# EAGLE board Sequencer-Memory-V1.0-3 (EAGLE 7.6.0)
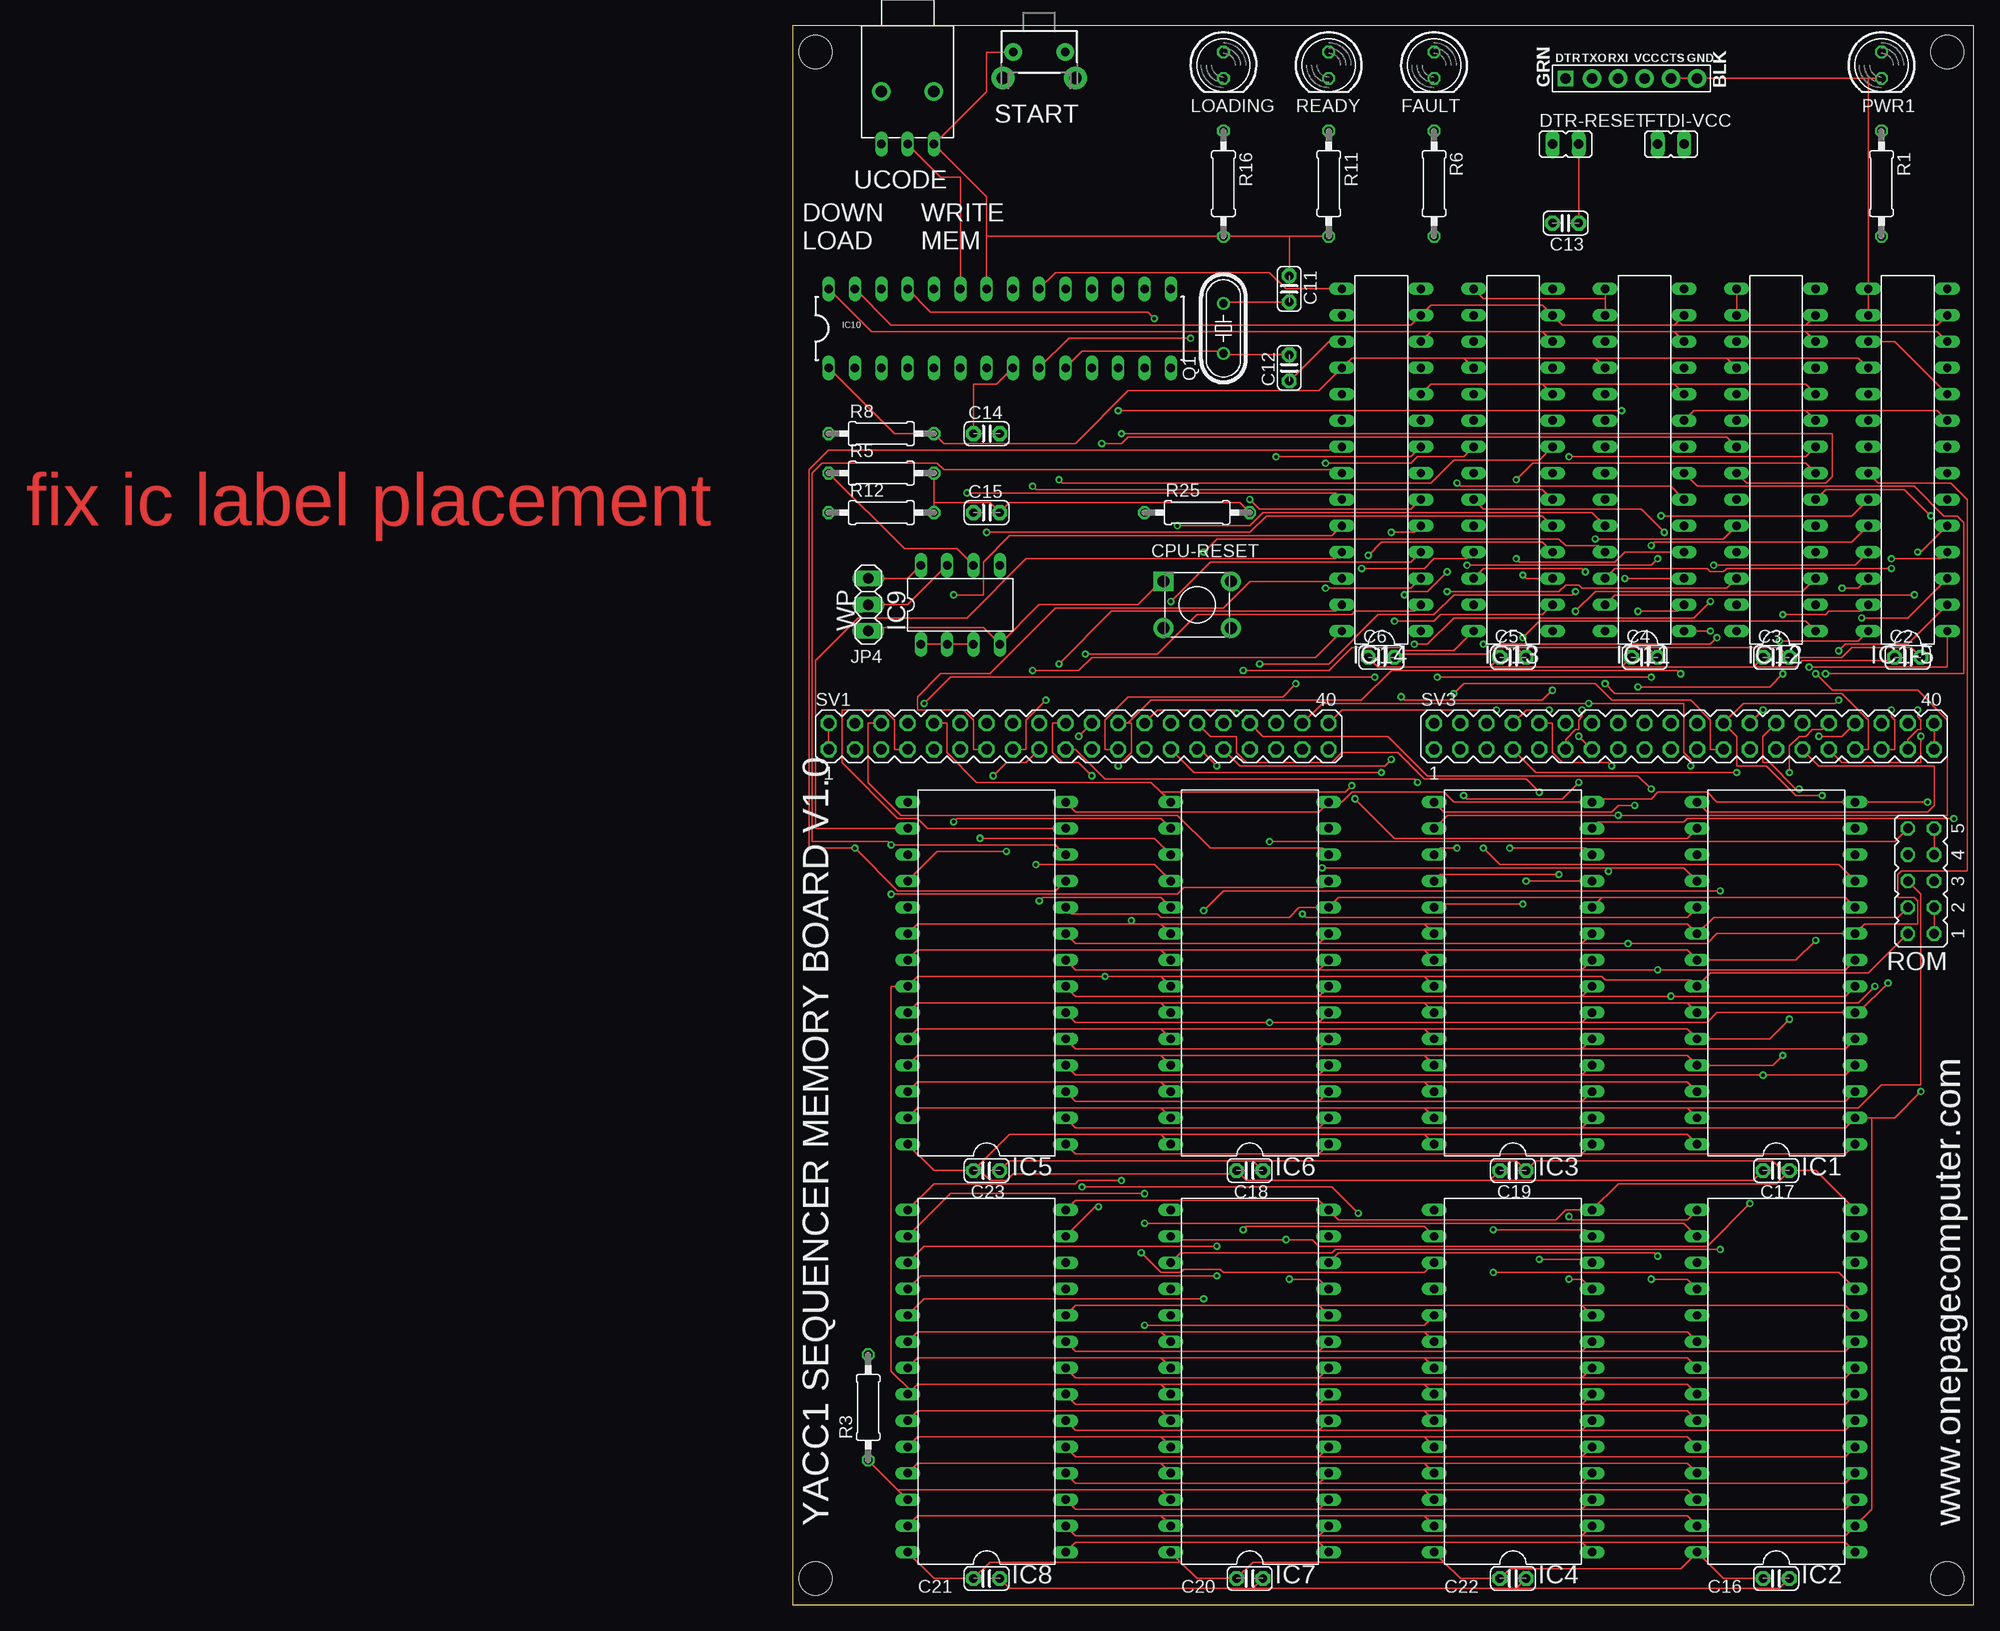
[diagram p4: board, top side]
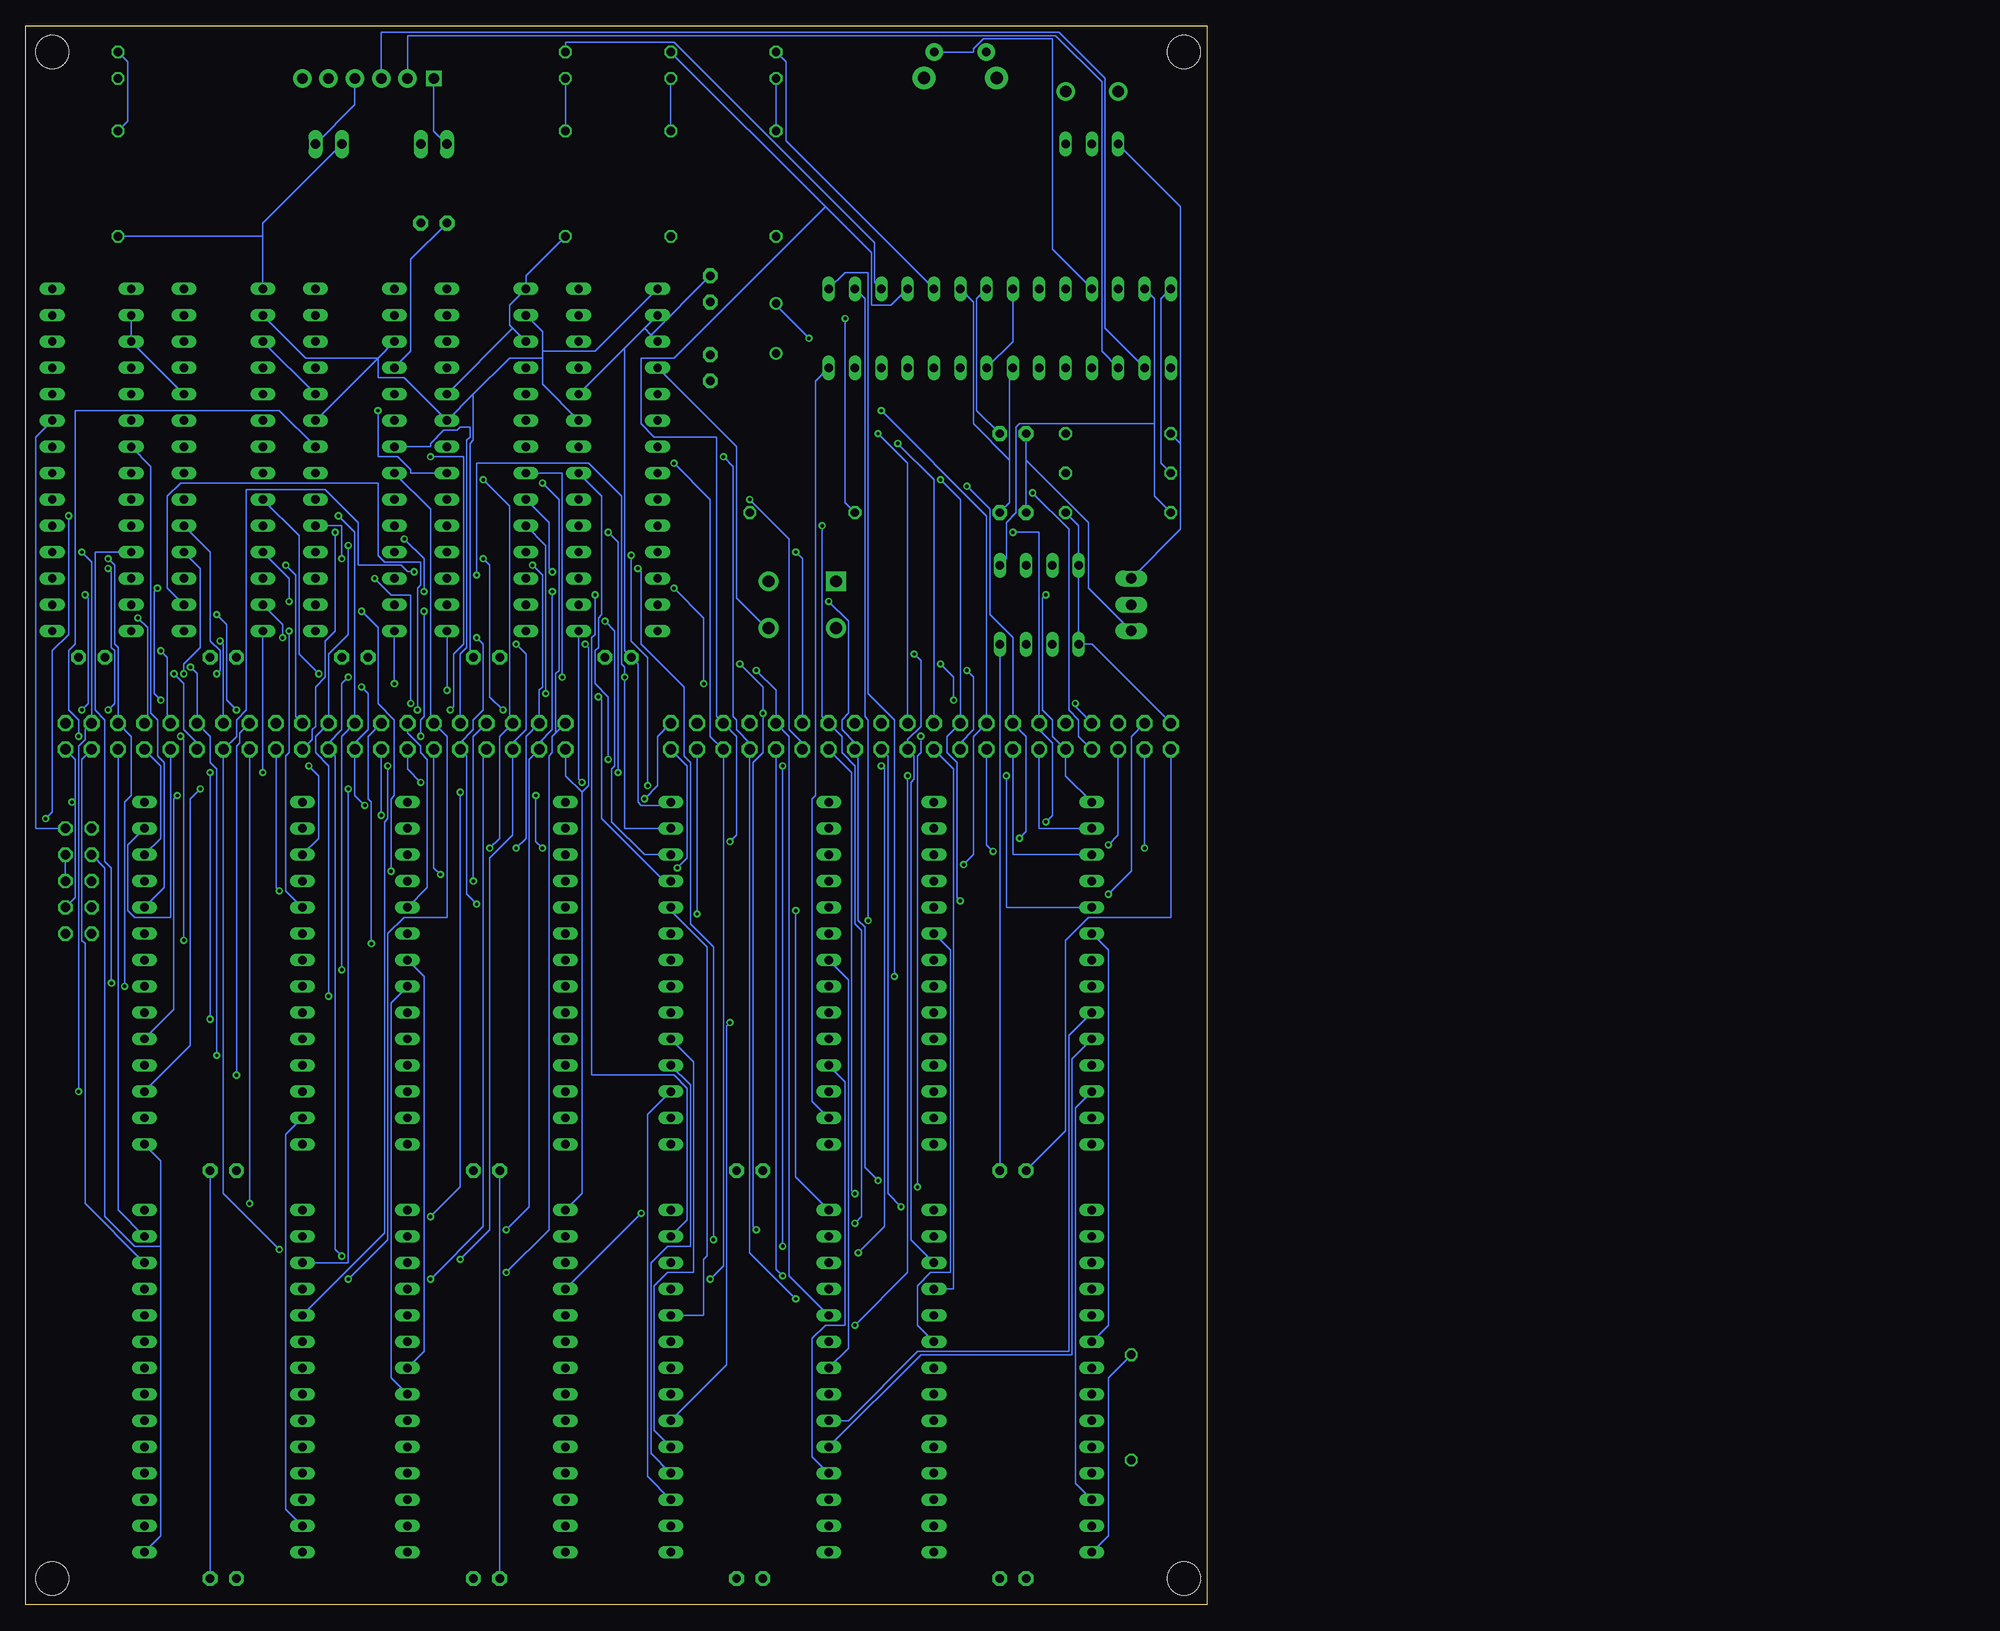
[diagram p5: board, bottom side, seen from below]

Size 113.97 x 152.38 mm. Coordinates in mm from the lower left corner, seen from the top.
Outline: 113.97,0 113.97,152.38 0,152.38 0,0 113.97,0
Copper layers (1*16): Top 0.0356mm / dielectric 1.5011mm / Bottom 0.0356mm
Design rules "LaenPCBOrder *": minimum track width 6mil, minimum drill 13mil, track to track 6mil, track to pad 6mil, pad to pad 6mil, via to via 6mil, smd to smd 6mil, copper to edge 15mil, drill to drill 6mil, minimum pad ring 7mil, minimum via ring 7mil, stop-mask expansion 3mil, vias tented up to drill 0mil, thermal gap 10mil
Holes 3.2 mm at 111.43,2.54 111.43,149.86 2.21,149.86 2.21,2.54

## Footprints (pad centres in the part's own frame; a part is rotated, then mirrored left to right if it is on the bottom)
C025-024X044 = drill 0.813 pad 1.422 octagon: 1 -1.27,0; 2 1.27,0
SW4-6.2X6.2X5.0MM = drill 1.143 pad 1.905 square: 1 -3.25,2.25 | drill 1.143 pad 1.905: 2 -3.25,-2.25; 3 3.25,-2.25; 4 3.25,2.25
JP1 = drill 0.914 long: 1 0,-1.27; 2 0,1.27
LED5MM = drill 0.813 octagon: A -1.27,0; K 1.27,0
DIL28-6 = drill 0.813 long: 1 -16.51,-7.62; 2 -13.97,-7.62; 3 -11.43,-7.62; 4 -8.89,-7.62; 5 -6.35,-7.62; 6 -3.81,-7.62; 7 -1.27,-7.62; 8 1.27,-7.62; 9 3.81,-7.62; 10 6.35,-7.62; 11 8.89,-7.62; 12 11.43,-7.62; 13 13.97,-7.62; 14 16.51,-7.62; 15 16.51,7.62; 16 13.97,7.62; 17 11.43,7.62; 18 8.89,7.62; 19 6.35,7.62; 20 3.81,7.62; 21 1.27,7.62; 22 -1.27,7.62; 23 -3.81,7.62; 24 -6.35,7.62; 25 -8.89,7.62; 26 -11.43,7.62; 27 -13.97,7.62; 28 -16.51,7.62
DIL28-3 = drill 0.813 long: 1 -16.51,-3.81; 2 -13.97,-3.81; 3 -11.43,-3.81; 4 -8.89,-3.81; 5 -6.35,-3.81; 6 -3.81,-3.81; 7 -1.27,-3.81; 8 1.27,-3.81; 9 3.81,-3.81; 10 6.35,-3.81; 11 8.89,-3.81; 12 11.43,-3.81; 13 13.97,-3.81; 14 16.51,-3.81; 15 16.51,3.81; 16 13.97,3.81; 17 11.43,3.81; 18 8.89,3.81; 19 6.35,3.81; 20 3.81,3.81; 21 1.27,3.81; 22 -1.27,3.81; 23 -3.81,3.81; 24 -6.35,3.81; 25 -8.89,3.81; 26 -11.43,3.81; 27 -13.97,3.81; 28 -16.51,3.81
DIL8 = drill 0.813 long: 1 -3.81,-3.81; 2 -1.27,-3.81; 3 1.27,-3.81; 4 3.81,-3.81; 5 3.81,3.81; 6 1.27,3.81; 7 -1.27,3.81; 8 -3.81,3.81
FTDI_DEVICE_SIDE = drill 1 square: P$1 -6.35,0 | drill 1.016 pad 1.778: P$2 -3.81,0; P$3 -1.27,0; P$4 1.27,0; P$5 3.81,0; P$6 6.35,0
1X03 = drill 1.016 long: 1 -2.54,0; 2 0,0; 3 2.54,0
HC49/S = drill 0.813: 1 -2.413,0; 2 2.413,0
0207/10 = drill 0.813 octagon: 1 -5.08,0; 2 5.08,0
JP5Q = drill 0.914 octagon: 1 -5.08,-1.27; 2 -5.08,1.27; 3 -2.54,-1.27; 4 -2.54,1.27; 5 0,-1.27; 6 0,1.27; 7 2.54,-1.27; 8 2.54,1.27; 9 5.08,-1.27; 10 5.08,1.27
TACTILE-PTH-SIDEEZ = drill 0.8 pad 1.7: 1 -2.5,0; 2 2.5,0 | drill 1.2 pad 2.2: ANCHOR1 -3.5,2.5; ANCHOR2 3.5,2.5
MA20-2 = drill 1.016 octagon: 1 -24.13,-1.27; 2 -24.13,1.27; 3 -21.59,-1.27; 4 -21.59,1.27; 5 -19.05,-1.27; 6 -19.05,1.27; 7 -16.51,-1.27; 8 -16.51,1.27; 9 -13.97,-1.27; 10 -13.97,1.27; 11 -11.43,-1.27; 12 -11.43,1.27; 13 -8.89,-1.27; 14 -8.89,1.27; 15 -6.35,-1.27; 16 -6.35,1.27; 17 -3.81,-1.27; 18 -3.81,1.27; 19 -1.27,-1.27; 20 -1.27,1.27; 21 1.27,-1.27; 22 1.27,1.27; 23 3.81,-1.27; 24 3.81,1.27; 25 6.35,-1.27; 26 6.35,1.27; 27 8.89,-1.27; 28 8.89,1.27; 29 11.43,-1.27; 30 11.43,1.27; 31 13.97,-1.27; 32 13.97,1.27; 33 16.51,-1.27; 34 16.51,1.27; 35 19.05,-1.27; 36 19.05,1.27; 37 21.59,-1.27; 38 21.59,1.27; 39 24.13,-1.27; 40 24.13,1.27
9070-1W = drill 0.813 long: 1 5.08,-2.54; 2 5.08,0; 3 5.08,2.54 | drill 1.118 pad 1.778: B 0,-2.54; B1 0,2.54

## Placement (x,y rotation side)
C2  0.1  [C025-024X044]  107.62,91.44 0 top
C3  0.1  [C025-024X044]  94.92,91.44 0 top
C4  0.1  [C025-024X044]  82.22,91.44 0 top
C5  0.1  [C025-024X044]  69.52,91.44 0 top
C6  0.1  [C025-024X044]  56.82,91.44 0 top
C11  20pf  [C025-024X044]  47.93,127 270 top
C12  20pf  [C025-024X044]  47.93,119.38 90 top
C13  0.1  [C025-024X044]  74.6,133.35 180 top
C14  0.1  [C025-024X044]  18.72,113.03 0 top
C15  0.1  [C025-024X044]  18.72,105.41 0 top
C16  0.1  [C025-024X044]  94.92,2.54 180 top
C17  0.1  [C025-024X044]  94.92,41.91 180 top
C18  0.1  [C025-024X044]  44.12,41.91 180 top
C19  0.1  [C025-024X044]  69.52,41.91 180 top
C20  0.1  [C025-024X044]  44.12,2.54 180 top
C21  0.1  [C025-024X044]  18.72,2.54 180 top
C22  0.1  [C025-024X044]  69.52,2.54 180 top
C23  0.1  [C025-024X044]  18.72,41.91 180 top
CPU-RESET  TS-1109-7  [SW4-6.2X6.2X5.0MM]  39.04,96.52 0 top
DTR-RESET  [JP1]  74.6,140.97 270 top
FAULT  [LED5MM]  61.9,148.59 270 top
FTDI-VCC  [JP1]  84.76,140.97 270 top
IC1  [DIL28-6]  94.92,60.96 90 top
IC1-5  MCP23017SP  [DIL28-3]  107.62,110.49 90 top
IC2  [DIL28-6]  94.92,21.59 90 top
IC3  [DIL28-6]  69.52,60.96 90 top
IC4  [DIL28-6]  69.52,21.59 90 top
IC5  [DIL28-6]  18.72,60.96 90 top
IC6  [DIL28-6]  44.12,60.96 90 top
IC7  [DIL28-6]  44.12,21.59 90 top
IC8  [DIL28-6]  18.72,21.59 90 top
IC9  24AA01P  [DIL8]  16.18,96.52 0 top
IC10  ATMEGA328P_PDIP  [DIL28-3]  19.99,123.19 0 top
IC11  MCP23017SP  [DIL28-3]  82.22,110.49 90 top
IC12  MCP23017SP  [DIL28-3]  94.92,110.49 90 top
IC13  MCP23017SP  [DIL28-3]  69.52,110.49 90 top
IC14  MCP23017SP  [DIL28-3]  56.82,110.49 90 top
JP3  FTDI_DEVICE  [FTDI_DEVICE_SIDE]  80.95,147.32 0 top
JP4  [1X03]  7.29,96.52 90 top
LOADING  [LED5MM]  41.58,148.59 270 top
PWR1  [LED5MM]  105.08,148.59 270 top
Q1  16Mhz  [HC49/S]  41.58,123.19 90 top
R1  330  [0207/10]  105.08,137.16 270 top
R3  10k  [0207/10]  7.29,19.05 90 top
R5  2.2k  [0207/10]  8.56,109.22 0 top
R6  330  [0207/10]  61.9,137.16 270 top
R8  10k  [0207/10]  8.56,113.03 0 top
R11  330  [0207/10]  51.74,137.16 270 top
R12  2.2k  [0207/10]  8.56,105.41 0 top
R16  330  [0207/10]  41.58,137.16 270 top
R25  10k  [0207/10]  39.04,105.41 0 top
READY  [LED5MM]  51.74,148.59 270 top
ROM  [JP5Q]  108.89,69.85 90 top
START  SWITCH-MOMENTARY-2SIDE_EZ  [TACTILE-PTH-SIDEEZ]  23.8,149.86 180 top
SV1  [MA20-2]  27.61,83.82 0 top
SV3  [MA20-2]  86.03,83.82 0 top
UCODE  [9070-1W]  11.1,146.05 270 top

## Tracks (layer width: path | path; a pad name or v marks a point on that pad's centre or on a via)
1-BYTE-OPERAND-SEL  (via drill 0.33)
  Top 0.152: v108.89,83.82 108.89,81.28 101.27,81.28 SV3.31
  Bottom 0.152: IC1.13 104.13,73.34 104.13,66.99 103.49,66.36 100,66.36 SV3.31 | IC11.8 89.52,115.25 109.21,115.25 109.21,92.71 109.84,92.08 109.84,86.36 108.89,85.41 v108.89,83.82
2-BYTE-OPERAND-SEL  (via drill 0.33)
  Top 0.152: IC1.15 88.25,76.52 109.53,76.52 110.16,77.15 110.16,80.96 99.05,80.96 SV3.29 | IC11.7 87.3,107.95 108.25,107.95 111.11,105.09 112.38,105.09 113.02,104.46 113.02,89.85 v99.68,89.85
  Bottom 0.152: v99.68,89.85 98.73,88.9 98.73,84.45 97.46,83.19 SV3.29
-CMEMRD  (via drill 0.33)
  Top 0.152: 11.42,20.64 12.05,21.27 35.55,21.27 | IC7.22 35.55,21.27 | 60.95,21.27 IC4.22 | 35.55,21.27 60.95,21.27 | IC2.22 86.35,21.27 60.95,21.27 | ROM.2 103.81,60.96 88.57,60.96 IC1.22 86.67,60.33 78.41,60.33 78.09,60.64 60.95,60.64 | 35.55,60.64 v30.15,60.64 12.05,60.64 IC5.22 9.51,59.69 9.51,22.54 11.42,20.64 | IC6.22 35.55,60.64 | 60.95,60.64 IC3.22 | 35.55,60.64 60.95,60.64 | 11.42,20.64 IC8.22
  Bottom 0.152: IC10.15 34.91,128.59 32.69,128.59 32.69,87.95 30.15,85.41 v30.15,60.64
-CMEMSEL  (via drill 0.33)
  Top 0.152: IC8.20 12.05,26.35 35.55,26.35 | IC7.20 35.55,26.35 | 60.95,26.35 IC4.20 | 35.55,26.35 60.95,26.35 | IC2.20 86.35,26.35 60.95,26.35 | ROM.4 106.67,66.36 88.89,66.36 IC1.20 86.35,65.72 60.95,65.72 | IC5.20 12.05,65.72 32.69,65.72 | 35.55,65.72 32.69,65.72 | IC6.20 35.55,65.72 | 32.69,65.72 v32.69,66.04 | 60.95,65.72 IC3.20 | 35.55,65.72 60.95,65.72
  Bottom 0.152: IC10.16 33.01,126.05 33.01,85.72 32.69,85.41 v32.69,66.04 | IC8.20 9.51,26.99 9.51,63.18 IC5.20
-CMEMWR
  Top 0.152: IC8.27 12.05,8.57 35.55,8.57 | IC7.27 35.55,8.57 | 60.95,8.57 IC4.27 | 35.55,8.57 60.95,8.57 | IC2.27 86.35,8.57 60.95,8.57 | IC5.27 12.05,47.94 35.55,47.94 | IC6.27 35.55,47.94 | 60.95,47.94 IC3.27 | 35.55,47.94 60.95,47.94 | 86.35,47.94 IC1.27 | 60.95,47.94 86.35,47.94 | ROM.6 108.89,68.58 108.89,50.16 105.08,50.16 102.86,47.94 86.35,47.94
  Bottom 0.152: IC10.14 37.77,118.11 37.77,78.11 38.09,77.79 38.09,48.58 IC6.27 | IC2.27 88.89,9.21 88.89,45.4 IC1.27
-RESET
  Top 0.152: IC10.1 9.83,113.03 R8.2 14.59,112.08 27.29,112.08 32.37,117.16 50.79,117.16 IC14.18 53.96,120.33 64.76,120.33 | IC13.18 64.76,120.33 | 77.46,120.33 IC11.18 | 64.76,120.33 77.46,120.33 | 90.16,120.33 IC12.18 | 77.46,120.33 90.16,120.33 | IC1-5.18 102.86,120.33 90.16,120.33
  Bottom 0.152: C13.2 76.82,129.86 76.82,120.97 IC11.18 | IC14.18 45.39,111.76 45.39,97.16 42.53,94.3 CPU-RESET.3
AC-LD  (via drill 0.33)
  Top 0.152: IC3.17 62.54,73.03 v64.12,73.03 | v64.76,78.11 65.08,77.79 74.28,77.79 v75.87,79.38 | IC12.3 97.46,97.79 77.46,97.79 v75.55,95.89 | SV3.13 v75.87,83.82
  Bottom 0.152: v64.12,73.03 64.76,73.66 v64.76,78.11 | v75.87,79.38 77.14,80.64 SV3.13 | v75.55,95.89 75.55,85.72 75.87,85.41 v75.87,83.82
AC-LD-INV  (via drill 0.33)
  Top 0.152: IC3.18 62.54,70.48 v73.97,70.48 | v76.19,86.36 76.19,85.72 75.87,85.41 75.87,84.45 75.55,84.45 74.6,83.5 SV3.11
  Bottom 0.152: v73.97,70.48 74.6,71.12 SV3.11 | IC12.2 100.32,98.11 100.32,107 99.05,108.27 80,108.27 80,101.28 79.36,100.65 75.87,100.65 75.87,98.42 76.19,98.11 v76.19,86.36
AC-RD  (via drill 0.33)
  Top 0.152: IC3.16 63.17,76.2 v79.68,76.2 111.43,76.2 111.43,85.41 108.57,88.27 100.32,88.27 v98.73,89.85
  Bottom 0.152: SV3.15 v79.68,76.2 | IC12.4 97.14,100.01 97.14,92.39 98.73,90.81 v98.73,89.85
ADDR-ID0  (via drill 0.33)
  Top 0.152: IC5.13 13.01,74.93 12.05,75.88 10.15,75.88 4.75,81.28 4.75,86.36 8.88,86.36 9.83,85.41 9.83,82.55 SV1.7 | IC14.23 52.38,107.31 v16.82,107.31
  Bottom 0.152: v16.82,107.31 13.32,103.82 13.32,86.36 12.37,85.41 12.37,83.82 SV1.7
ADDR-ID1  (via drill 0.33)
  Top 0.152: IC14.24 52.06,103.19 20.94,103.19 18.4,100.65 18.4,97.47 v15.54,97.47
  Bottom 0.152: IC5.15 13.64,80.01 SV1.9 14.91,83.82 14.91,85.41 15.86,86.36 15.86,97.16 v15.54,97.47
ADDR-REG-ADDR-RD  (via drill 0.33)
  Top 0.152: IC6.19 35.55,68.26 24.12,68.26 v23.8,67.94 | IC13.8 72.06,110.49 63.81,110.49 61.58,108.27 26.02,108.27 v25.71,108.58
  Bottom 0.152: v23.8,67.94 24.12,68.26 24.12,81.28 25.07,82.23 25.07,83.82 SV1.18 23.8,106.68 v25.71,108.58
ADDR-REG-DATA-RD-HI  (via drill 0.33)
  Top 0.152: IC6.18 34.91,71.44 v23.48,71.44 | v31.42,115.25 v80,115.25
  Bottom 0.152: v23.48,71.44 22.53,72.39 22.53,83.82 SV1.16 21.26,105.09 v31.42,115.25 | IC13.7 76.82,109.22 76.82,109.54 78.09,110.81 80,110.81 v80,115.25
ADDR-REG-DATA-RD-LO  (via drill 0.33)
  Top 0.152: IC6.17 34.91,73.98 v18.09,73.98 | IC13.6 72.38,107.63 23.48,107.63 v23.17,107.95
  Bottom 0.152: v18.09,73.98 17.45,74.61 17.45,83.82 SV1.14 18.72,93.34 20.94,95.57 20.94,105.73 v23.17,107.95
ADDR-REG-DN  (via drill 0.33)
  Top 0.152: IC4.17 60.95,32.07 41.58,32.07 41.26,32.38 37.77,32.38 37.45,32.07 35.55,32.07 v33.64,33.97 | v31.42,80.96 32.69,82.23 32.69,85.09 32.37,85.09 | SV1.24 32.37,85.09 | v85.71,89.85 85.39,90.17 57.77,90.17 54.91,87.31 34.59,87.31 32.37,85.09
  Bottom 0.152: v33.64,33.97 31.1,36.51 31.1,80.64 v31.42,80.96 | IC12.23 87.62,103.19 87.62,91.76 v85.71,89.85
ADDR-REG-FUNC-LD  (via drill 0.33)
  Top 0.152: 35.55,78.42 34.59,79.38 17.77,79.38 14.91,82.23 14.91,85.09 SV1.10 | 35.55,78.42 IC6.15 | IC13.4 72.38,102.55 56.82,102.55 v55.55,101.28 | v53.96,79.06 53.33,78.42 35.55,78.42
  Bottom 0.152: v55.55,101.28 55.55,93.03 53.96,91.44 v53.96,79.06
ADDR-REG-FUNC-RD  (via drill 0.33)
  Top 0.152: IC6.16 35.55,75.88 15.86,75.88 v15.54,75.56 | IC13.5 72.38,105.09 45.71,105.09 44.12,103.5 v18.72,103.5
  Bottom 0.152: v15.54,75.56 14.91,76.2 14.91,83.19 16.18,84.45 SV1.12 16.18,103.5 v18.72,103.5
ADDR-REG-LD-HI  (via drill 0.33)
  Top 0.152: v54.6,37.78 52.06,40.32 v27.93,40.32 | SV1.22 v27.61,83.82 | IC12.22 92.06,108.27 99.68,108.27 100.32,108.9 100.32,113.03 v31.74,113.03
  Bottom 0.152: v54.6,37.78 IC4.18 | v27.93,40.32 27.93,81.92 27.61,82.23 v27.61,83.82 | v31.74,113.03 28.88,110.17 SV1.22
ADDR-REG-LD-LO  (via drill 0.33)
  Top 0.152: IC4.19 60.95,26.99 v33.96,26.99 | v28.88,80.01 27.61,81.28 26.02,81.28 25.07,82.23 25.07,85.09 SV1.20 | IC12.21 90.16,112.71 32.37,112.71 31.74,112.08 v29.83,112.08
  Bottom 0.152: v33.96,26.99 28.88,32.07 v28.88,80.01 | v29.83,112.08 26.34,108.58 SV1.20
ADDR-REG-UP  (via drill 0.33)
  Top 0.152: IC4.16 60.95,36.51 43.8,36.51 v43.48,36.2 | v42.85,86.04 42.53,86.36 35.23,86.36 SV1.26 | IC12.24 89.84,102.87 v77.46,102.87 | v75.55,97.79 75.23,97.47 63.81,97.47 61.9,95.57 56.5,95.57 51.74,90.81 v45.07,90.81
  Bottom 0.152: v43.48,36.2 43.8,36.51 43.8,81.28 42.85,82.23 v42.85,86.04 42.85,88.58 v45.07,90.81 | v77.46,102.87 75.55,100.97 v75.55,97.79
ALU0  (via drill 0.33)
  Top 0.152: IC4.13 76.5,36.2 v67.61,36.2 | IC12.26 90.16,98.11 76.19,98.11 75.87,98.42 74.6,98.42 73.97,97.79 v63.17,97.79
  Bottom 0.152: v67.61,36.2 65.39,38.42 65.39,81.6 SV3.3 64.44,83.19 63.17,84.45 v63.17,97.79
ALU1  (via drill 0.33)
  Top 0.152: IC4.12 76.82,33.34 v72.06,33.34 | v89.2,93.34 88.57,92.71 v66.66,92.71
  Bottom 0.152: v72.06,33.34 69.2,36.2 69.2,72.07 66.98,74.3 SV3.5 66.98,83.19 65.71,84.45 65.71,91.76 v66.66,92.71 | IC12.27 89.2,94.61 v89.2,93.34
ALU2  (via drill 0.33)
  Top 0.152: IC4.11 76.19,31.43 v74.92,31.43 | v91.11,80.33 71.74,80.33 SV3.7
  Bottom 0.152: v74.92,31.43 69.84,36.51 69.84,82.23 SV3.7 | v91.11,80.33 IC12.28
ALU3  (via drill 0.33)
  Top 0.152: IC3.19 62.22,67.63 v70.47,67.63 | IC12.1 97.78,94.93 72.06,94.93 v70.47,93.34
  Bottom 0.152: v70.47,67.63 71.42,68.58 71.42,81.92 SV3.9 72.06,83.19 70.79,84.45 70.79,85.41 69.84,86.36 69.84,92.71 v70.47,93.34
ALU-FUNC  (via drill 0.33)
  Top 0.152: v88.57,96.84 86.98,95.25 63.81,95.25 61.27,92.71 v60,92.71
  Bottom 0.152: IC4.15 60.31,39.69 60.31,78.42 | 60.31,78.42 61.9,80.01 SV3.1 | IC12.25 88.57,99.06 v88.57,96.84 | v60,92.71 59.68,92.39 59.68,79.06 60.31,78.42
ARD-RXIN
  Bottom 0.152: IC10.2 9.83,123.19 9.83,147.32 14.28,151.76 79.68,151.76 JP3.P$3
ARD-TXOUT
  Bottom 0.152: IC10.3 10.15,120.97 10.15,147 14.59,151.45 77.14,151.45 JP3.P$2
BR-COND  (via drill 0.33)
  Top 0.152: IC3.13 77.78,75.56 86.03,75.56 86.35,75.88 v112.06,75.88 | v109.84,105.09 107.3,107.63 99.68,107.63 IC12.6
  Bottom 0.152: v112.06,75.88 111.43,76.52 111.43,92.08 109.84,93.66 v109.84,105.09
BRANCH-LD-HI  (via drill 0.33)
  Top 0.152: IC1.16 86.35,73.98 58.09,73.98 v54.28,77.79 | IC11.4 80.31,101.6 79.36,100.65 70.16,100.65 v69.84,100.97 | v67.93,86.36 53.01,86.36 SV1.40
  Bottom 0.152: v54.28,77.79 53.01,79.06 53.01,83.82 SV1.40 | v69.84,100.97 69.2,100.33 69.2,87.63 v67.93,86.36
BRANCH-LD-LO  (via drill 0.33)
  Top 0.152: IC1.18 86.03,71.12 78.73,71.12 | v51.11,71.12 78.73,71.12 | IC11.2 85.39,95.89 v81.59,95.89 | 78.73,71.12 v78.73,70.8
  Bottom 0.152: v51.11,71.12 50.15,72.07 50.15,80.96 SV1.39 | v81.59,95.89 80,94.3 80,87 78.41,85.41 78.41,78.11 78.73,77.79 v78.73,70.8
BRANCH-RD-HI  (via drill 0.33)
  Top 0.152: v86.67,80.96 86.67,81.6 86.03,82.23 86.03,87 v76.82,87 51.11,87 SV1.38 | v80.31,99.06 IC11.3
  Bottom 0.152: IC1.17 85.71,73.98 85.71,80.01 v86.67,80.96 | v80.31,99.06 78.73,97.47 76.82,97.47 v76.82,87
BRANCH-RD-LO  (via drill 0.33)
  Top 0.152: IC11.1 v88.57,93.98 | v49.2,66.67 49.52,66.36 86.35,66.36 IC1.19
  Bottom 0.152: IC1.19 88.89,68.9 88.89,81.92 88.57,82.23 v88.57,93.98 | v49.2,66.67 SV1.37
BUS-EN  (via drill 0.33)
  Top 0.152: ROM.10 106.35,73.66 v46.02,73.66
  Bottom 0.152: IC10.18 30.47,125.41 32.37,125.41 32.37,130.49 36.82,134.94 | READY.A 36.82,134.94 | v46.02,73.66 45.39,74.3 45.39,83.82 SV1.36 47.3,85.72 47.3,112.71 53.33,112.71 54.6,113.98 54.6,120.33 51.42,120.33 36.82,134.94
CADDR0
  Top 0.152: IC8.10 27.29,28.89 50.79,28.89 | IC7.10 50.79,28.89 | 76.19,28.89 IC4.10 | 50.79,28.89 76.19,28.89 | IC2.10 101.59,28.89 76.19,28.89 | IC5.10 26.98,66.67 35.23,66.67 35.55,66.36 47.93,66.36 48.88,67.31 IC6.10 52.69,68.26 78.09,68.26 | IC1.10 101.59,68.26 78.09,68.26 | IC3.10 78.09,68.26
  Bottom 0.152: IC3.10 75.23,69.22 75.23,81.6 75.87,82.23 75.87,82.87 77.14,84.14 SV3.14 | IC1-5.21 101.91,109.86 101.91,86.04 101.27,85.41 101.27,81.92 100.64,81.28 100.64,69.22 IC1.10 | IC7.10 48.57,27.94 48.57,33.34 48.25,33.66 48.25,63.5 51.74,66.99 IC6.10
CADDR1  (via drill 0.33)
  Top 0.152: IC8.9 27.29,24.45 50.79,24.45 | IC7.9 50.79,24.45 | 76.19,24.45 IC4.9 | 50.79,24.45 76.19,24.45 | IC2.9 101.59,24.45 76.19,24.45 | IC5.9 27.29,63.82 50.79,63.82 | IC6.9 50.79,63.82 | 76.19,63.82 IC3.9 | 50.79,63.82 76.19,63.82 | 76.19,63.82 v80.63,63.82 88.25,63.82 89.2,64.77 IC1.9 103.49,65.72 108.57,65.72 108.57,67.94 108.25,68.26 106.67,68.26 106.67,70.48 106.98,70.8 113.34,70.8 113.34,106.68 111.75,108.27 104.76,108.27 IC1-5.22
  Bottom 0.152: SV3.16 80.95,83.82 80.95,77.79 80.63,77.47 v80.63,63.82 | IC8.9 27.93,26.99 27.93,30.8 26.66,32.07 24.75,32.07 24.75,63.18 IC5.9
CADDR2  (via drill 0.33)
  Top 0.152: IC8.8 27.29,21.91 50.79,21.91 | IC7.8 50.79,21.91 | 76.19,21.91 IC4.8 | 50.79,21.91 76.19,21.91 | IC2.8 101.59,21.91 76.19,21.91 | IC1-5.23 102.22,105.09 v83.81,105.09 | IC5.8 27.29,61.28 50.79,61.28 | IC6.8 50.79,61.28 | 76.19,61.28 IC3.8 | 50.79,61.28 76.19,61.28 | IC1.8 101.59,61.28 v83.49,61.28 76.19,61.28
  Bottom 0.152: v83.81,105.09 82.22,103.5 SV3.18 83.49,83.82 v83.49,61.28 | IC4.8 75.55,24.45 75.55,60.64 IC3.8
CADDR3  (via drill 0.33)
  Top 0.152: IC8.7 27.29,19.37 50.79,19.37 | IC7.7 50.79,19.37 | 76.19,19.37 IC4.7 | 50.79,19.37 76.19,19.37 | IC2.7 101.59,19.37 76.19,19.37 | IC1-5.24 102.22,102.55 83.17,102.55 v82.86,102.23 | IC5.7 27.29,58.74 50.79,58.74 | IC6.7 50.79,58.74 | 76.19,58.74 IC3.7 | 50.79,58.74 76.19,58.74 | IC1.7 101.59,58.74 v84.76,58.74 76.19,58.74
  Bottom 0.152: v82.86,102.23 82.86,93.66 84.76,91.76 SV3.20 86.03,83.82 86.03,82.23 84.76,80.96 v84.76,58.74 | IC4.7 78.73,21.91 78.73,58.1 IC3.7
CADDR4  (via drill 0.33)
  Top 0.152: IC8.6 27.29,16.83 50.79,16.83 | IC7.6 50.79,16.83 | 76.19,16.83 IC4.6 | 50.79,16.83 76.19,16.83 | IC2.6 101.59,16.83 76.19,16.83 | IC1-5.25 102.54,100.33 v88.89,100.33 | IC5.6 27.29,56.2 v46.02,56.2 50.79,56.2 | IC6.6 50.79,56.2 | 76.19,56.2 IC3.6 | 50.79,56.2 76.19,56.2 | 76.19,56.2 88.25,56.2 89.2,57.15 IC1.6 102.86,57.15 v105.72,60.01
  Bottom 0.152: v88.89,100.33 87.94,99.38 87.94,85.72 SV3.22 | IC1-5.25 107.3,101.6 107.3,86.36 106.35,85.41 106.35,71.75 105.72,71.12 v105.72,60.01 | IC7.6 46.34,23.18 46.34,55.88 v46.02,56.2
CADDR5  (via drill 0.33)
  Top 0.152: IC8.5 27.29,14.29 50.79,14.29 | IC7.5 50.79,14.29 | 76.19,14.29 IC4.5 | 50.79,14.29 76.19,14.29 | IC2.5 101.59,14.29 76.19,14.29 | IC1-5.26 102.86,98.11 v101.27,98.11 | v100.95,87.31 100.64,87 91.75,87 SV3.24 91.11,83.82 91.11,80.96 93.97,80.96 96.83,78.11 v99.36,78.11 | IC5.5 27.29,53.66 50.79,53.66 | IC6.5 50.79,53.66 | 76.19,53.66 IC3.5 | 50.79,53.66 76.19,53.66 | IC1.5 101.59,53.66 76.19,53.66
  Bottom 0.152: v101.27,98.11 101.59,97.79 101.59,87.95 v100.95,87.31 | v99.36,78.11 99.68,77.79 99.68,57.47 IC1.5 | IC7.5 53.33,16.83 53.33,30.8 52.06,32.07 49.52,32.07 49.52,52.39 IC6.5
CADDR6  (via drill 0.33)
  Top 0.152: IC8.4 27.29,11.75 50.79,11.75 | IC7.4 50.79,11.75 | 76.19,11.75 IC4.4 | 50.79,11.75 76.19,11.75 | IC2.4 101.59,11.75 76.19,11.75 | IC1-5.27 103.17,95.89 100,95.89 99.68,95.57 v95.56,95.57 | SV3.26 v93.65,86.36 | IC5.4 27.29,51.12 50.79,51.12 | IC6.4 50.79,51.12 | 76.19,51.12 IC3.4 | 50.79,51.12 76.19,51.12 | IC1.4 101.59,51.12 v93.65,51.12 76.19,51.12
  Bottom 0.152: v95.56,95.57 94.6,94.61 94.6,87.31 v93.65,86.36 | SV3.26 93.33,84.14 93.33,83.19 93.65,82.87 v93.65,51.12 | IC7.4 53.65,14.61 53.65,33.02 52.06,34.61 49.84,34.61 49.84,50.16 IC6.4
CADDR7  (via drill 0.33)
  Top 0.152: IC8.3 27.29,9.21 50.79,9.21 | IC7.3 50.79,9.21 | 76.19,9.21 IC4.3 | 50.79,9.21 76.19,9.21 | IC2.3 101.59,9.21 76.19,9.21 | IC1-5.28 102.86,93.03 v95.24,93.03 | IC5.3 27.29,48.58 50.79,48.58 | IC6.3 50.79,48.58 | 76.19,48.58 IC3.3 | 50.79,48.58 76.19,48.58 | IC1.3 101.59,48.58 76.19,48.58 | SV3.28 93.65,83.82 93.65,81.28 94.28,81.28 96.83,78.74 v97.14,78.74
  Bottom 0.152: v95.24,93.03 94.92,92.71 SV3.28 | v97.14,78.74 98.09,77.79 98.09,53.98 IC1.3 | IC7.3 53.96,12.38 53.96,47.31 IC6.3
CADDR8  (via drill 0.33)
  Top 0.152: IC8.25 12.05,13.65 35.55,13.65 | IC7.25 35.55,13.65 | 60.95,13.65 IC4.25 | 35.55,13.65 60.95,13.65 | IC2.25 86.35,13.65 60.95,13.65 | IC1-5.1 111.43,90.49 v98.09,90.49 | IC5.25 12.05,53.02 35.55,53.02 | IC6.25 35.55,53.02 | 60.95,53.02 IC3.25 | 35.55,53.02 60.95,53.02 | 60.95,53.02 86.35,53.02 IC1.25 94.6,52.07 v95.56,53.02
  Bottom 0.152: v98.09,90.49 97.46,89.85 SV3.30 96.19,83.82 96.19,81.28 95.56,80.64 v95.56,53.02 | IC7.25 38.09,14.29 38.09,25.72 36.82,26.99 34.91,26.99 34.91,50.48 IC6.25
CADDR9  (via drill 0.33)
  Top 0.152: IC8.24 12.05,16.19 35.55,16.19 | IC7.24 35.55,16.19 | 60.95,16.19 IC4.24 | 35.55,16.19 60.95,16.19 | IC2.24 86.35,16.19 60.95,16.19 | IC1-5.2 107.62,92.71 101.59,92.71 v100.95,92.08 | IC5.24 12.05,55.56 35.55,55.56 | IC6.24 35.55,55.56 | 60.95,55.56 IC3.24 | 35.55,55.56 60.95,55.56 | 60.95,55.56 86.35,55.56 IC1.24 94.28,54.61 v96.19,56.52 | SV3.32 99.36,84.45 98.41,84.45 97.78,83.82 97.14,83.82 96.19,82.87 v96.19,80.33
  Bottom 0.152: v100.95,92.08 100.32,91.44 100.32,85.41 SV3.32 | v96.19,56.52 v96.19,80.33 | IC7.24 27.61,24.13 13.01,24.13 13.01,52.7 IC5.24
CADDR10  (via drill 0.33)
  Top 0.152: IC8.21 12.05,23.81 35.55,23.81 | IC7.21 35.55,23.81 | 60.95,23.81 IC4.21 | 35.55,23.81 60.95,23.81 | IC2.21 86.35,23.81 60.95,23.81 | IC1-5.3 107.62,95.25 v103.17,95.25 | IC5.21 12.05,63.18 35.55,63.18 | IC6.21 35.55,63.18 | 60.95,63.18 IC3.21 | 35.55,63.18 60.95,63.18 | 60.95,63.18 86.35,63.18 IC1.21 96.83,62.23 v98.73,64.14 | SV3.34 101.27,83.82 v99.05,83.82
  Bottom 0.152: v103.17,95.25 102.22,94.3 102.22,85.41 SV3.34 | v99.05,83.82 98.73,83.5 v98.73,64.14 | IC7.21 34.59,24.77 34.59,60.33 IC6.21
CADDR11  (via drill 0.33)
  Top 0.152: IC8.23 12.05,18.73 35.55,18.73 | IC7.23 35.55,18.73 | 60.95,18.73 IC4.23 | 35.55,18.73 60.95,18.73 | IC2.23 86.35,18.73 60.95,18.73 | IC1-5.4 110.8,100.97 v106.03,100.97 | IC5.23 12.05,58.1 35.55,58.1 | IC6.23 35.55,58.1 | 60.95,58.1 IC3.23 | 35.55,58.1 60.95,58.1 | 86.35,58.1 IC1.23 | 60.95,58.1 86.35,58.1 | v104.45,59.69 102.86,58.1 86.35,58.1
  Bottom 0.152: v106.03,100.97 105.4,100.33 105.4,92.71 105.08,92.39 SV3.36 103.81,83.82 103.81,78.11 104.45,77.47 v104.45,59.69 | IC7.23 34.59,17.78 27.93,24.45 13.32,24.45 13.32,54.93 IC5.23
CADDR12  (via drill 0.33)
  Top 0.152: IC8.2 27.29,6.67 50.79,6.67 | IC7.2 50.79,6.67 | 76.19,6.67 IC4.2 | 50.79,6.67 76.19,6.67 | 76.19,6.67 101.59,6.67 IC2.2 104.13,9.21 104.13,46.99 | IC1-5.5 108.89,101.6 v108.57,101.6 | IC5.2 27.29,46.04 50.79,46.04 | IC6.2 50.79,46.04 | 76.19,46.04 IC3.2 | 50.79,46.04 76.19,46.04 | 76.19,46.04 101.59,46.04 IC1.2 104.13,46.99 | v108.89,49.53 106.35,46.99 104.13,46.99
  Bottom 0.152: v108.57,101.6 107.62,100.65 SV3.38 108.25,84.45 108.25,83.5 108.89,82.87 v108.89,49.53
CMEMSEL
  Top 0.152: IC5.26 12.05,50.48 35.55,50.48 | IC6.26 35.55,50.48 | 60.95,50.48 IC3.26 | 35.55,50.48 60.95,50.48 | IC1.26 86.35,50.48 60.95,50.48 | R3.1 10.15,11.11 | 10.15,11.11 IC8.26 | 35.55,11.11 IC7.26 | 10.15,11.11 35.55,11.11 | 60.95,11.11 IC4.26 | 35.55,11.11 60.95,11.11 | IC2.26 86.35,11.11 60.95,11.11
  Bottom 0.152: IC5.26 12.69,47.94 12.69,11.75 IC8.26
FAULT
  Bottom 0.152: IC10.17 32.05,127.64 32.05,131.44 51.42,150.81 61.9,150.81 FAULT.A
GND  (via drill 0.33)
  Top 0.152: C21.1 20.94,1.59 44.44,1.59 | C20.1 44.44,1.59 | 69.84,1.59 C22.1 | 44.44,1.59 69.84,1.59 | C16.1 95.24,1.59 69.84,1.59 | C23.1 20.94,42.86 44.44,42.86 | C18.1 44.44,42.86 | 44.44,42.86 69.84,42.86 C19.1 71.74,42.86 94.6,42.86 95.87,41.59 | IC8.14 27.29,39.05 50.79,39.05 IC7.14 52.69,37.15 73.65,37.15 74.6,38.1 IC4.14 79.68,40.64 94.92,40.64 95.87,41.59 | IC2.14 98.73,41.91 C17.1 95.87,41.59 | C6.1 56.5,90.49 67.3,90.49 | C5.1 67.3,90.49 | 80,90.49 C4.1 | 67.3,90.49 80,90.49 | 92.7,90.49 C3.1 | 80,90.49 92.7,90.49 | C2.1 106.03,91.12 97.46,91.12 96.83,90.49 92.7,90.49 | ROM.3 ROM.1 | SV3.40 SV3.39 | IC5.14 27.29,76.52 50.79,76.52 IC6.14 53.01,77.47 53.96,78.42 62.85,78.42 63.81,77.47 IC3.14 77.46,77.79 82.86,77.79 83.49,78.42 88.25,78.42 89.2,77.47 IC1.14 v109.53,77.47 | JP4.1 7.61,94.3 18.4,94.3 IC9.4 23.8,96.52 33.33,96.52 35.55,98.74 CPU-RESET.1 | START.2 18.72,149.86 18.72,146.05 UCODE.3 18.72,135.89 18.72,132.08 | C14.1 17.45,117.79 19.67,117.79 IC10.8 | IC10.22 18.72,132.08 | 103.81,147.32 JP3.P$6 JP3.P$5 | 103.81,147.32 PWR1.K | IC1-5.16 IC1-5.15 103.81,147.32 | IC1-5.10 106.35,121.92 IC1-5.17 | IC11.15 78.41,126.05 | 78.41,126.05 IC11.16 | 78.41,126.05 66.66,126.05 IC13.15 | R11.2 47.93,132.08 | 47.93,132.08 R16.2 18.72,132.08 | 47.93,132.08 C11.1 | 72.38,117.79 IC13.10 | 72.38,117.79 61.58,117.79 IC14.10 | C12.1 51.74,121.92 IC14.17 | 85.08,117.79 IC11.10 | 72.38,117.79 85.08,117.79 | IC12.10 97.78,117.79 85.08,117.79
  Bottom 0.152: C17.1 C16.1 | ROM.3 109.21,68.26 109.21,77.47 | 109.21,77.47 109.21,81.6 SV3.39 | v109.53,77.47 109.21,77.47 | IC6.14 51.74,77.15 54.6,77.15 54.91,77.47 54.91,90.81 C6.1 56.19,92.08 56.19,121.28 | C14.1 17.45,110.49 | 17.45,110.49 C15.1 | IC10.8 18.72,121.92 IC10.22 | JP4.1 11.42,98.11 11.42,104.46 17.45,110.49 | IC12.10 IC1-5.17 IC1-5.16 | 66.98,123.19 67.3,123.51 67.3,125.41 IC13.15 65.71,128.27 R6.2 | 66.98,123.19 IC13.17 | IC12.17 IC11.10 | IC14.16 54.28,123.19 | 54.28,123.19 56.19,121.28 | 56.19,121.28 IC14.10 | 54.28,123.19 53.65,122.56 | 53.65,122.56 IC14.17 | 53.65,122.56 C11.1 | IC13.10 66.98,123.19 | IC9.4 C23.1
H/L-SWAP  (via drill 0.33)
  Top 0.152: IC3.12 76.5,73.03 v69.2,73.03 | IC12.7 97.78,110.17 71.42,110.17 v69.84,108.58
  Bottom 0.152: v69.2,73.03 68.25,73.98 68.25,83.82 67.3,84.77 | v69.84,108.58 67.3,106.05 67.3,84.77 | 67.3,84.77 SV3.6
HALT  (via drill 0.33)
  Top 0.152: v70.47,99.38 70.79,99.06 IC13.3 | v12.69,87 15.23,89.53 v56.19,89.53
  Bottom 0.152: IC6.13 56.19,74.93 v56.19,89.53 56.19,90.49 56.5,90.81 56.5,107 59.68,110.17 70.47,110.17 v70.47,99.38 | SV1.8 12.69,86.68 v12.69,87
I/O-ADDR  (via drill 0.33)
  Top 0.152: IC7.17 37.45,33.97 52.06,33.97 52.38,34.29 v89.52,34.29 | IC13.26 66.66,100.01 76.19,100.01 v76.5,99.69
  Bottom 0.152: v89.52,34.29 94.92,39.69 SV3.27 93.65,83.82 93.65,85.41 92.7,86.36 92.7,107.63 85.08,107.63 81.9,104.46 81.9,100.33 77.78,100.33 77.14,99.69 v76.5,99.69
I/O-RD  (via drill 0.33)
  Top 0.152: IC7.16 36.82,35.24 v47.61,35.24 50.15,35.24 50.79,34.61 88.25,34.61 v92.38,38.73 | IC13.25 65.08,100.97 61.9,100.97 60.95,100.01 v54.91,100.01
  Bottom 0.152: SV3.25 v92.38,38.73 | v54.91,100.01 54.6,99.69 54.6,92.71 50.47,88.58 50.47,81.92 49.84,81.28 49.84,65.72 47.61,63.5 v47.61,35.24
I/O-WR  (via drill 0.33)
  Top 0.152: v39.68,66.99 41.58,68.9 v89.52,68.9 | v63.81,87.95 64.76,88.9 77.46,88.9 79.05,87.31 86.67,87.31 88.57,85.41 88.57,82.55 SV3.23
  Bottom 0.152: IC7.15 39.68,41.27 v39.68,66.99 | v89.52,68.9 89.84,69.22 SV3.23 | IC13.24 63.81,102.23 v63.81,87.95
INT-EN  (via drill 0.33)
  Top 0.152: IC2.15 86.35,37.15 75.23,37.15 v74.92,37.47 | v72.06,78.42 70.79,79.69 60.95,79.69 58.41,82.23 53.01,82.23 52.06,81.28 43.8,81.28 42.85,82.23 42.85,83.82 40.31,83.82 SV1.30 | IC11.25 77.78,102.23 74.6,102.23 73.97,102.87 40.95,102.87 v39.68,101.6
  Bottom 0.152: v74.92,37.47 72.06,40.32 v72.06,78.42 | v39.68,101.6 39.04,100.97 SV1.30
INT-JMP  (via drill 0.33)
  Top 0.152: IC1.11 100.95,71.44 68.25,71.44 v66.66,73.03 | v83.49,100.97 82.86,100.33 v65.08,100.33
  Bottom 0.152: v66.66,73.03 65.71,73.98 65.71,83.82 SV3.4 64.44,88.27 64.12,88.58 64.12,99.38 v65.08,100.33 | IC11.5 83.49,104.14 v83.49,100.97
INT-LD  (via drill 0.33)
  Top 0.152: IC2.11 100.95,32.07 v67.61,32.07 | IC11.6 84.76,107.95 64.44,107.95 v64.12,108.27
  Bottom 0.152: v67.61,32.07 63.49,36.2 63.49,81.92 63.17,82.23 63.17,83.82 62.85,84.14 | SV3.2 62.85,84.14 | v64.12,108.27 62.54,106.68 62.54,90.17 62.85,89.85 62.85,84.14
INT-START  (via drill 0.33)
  Top 0.152: IC2.16 86.03,36.83 v33.96,36.83 | IC11.24 77.14,105.41 45.39,105.41 44.12,104.14 v37.14,104.14
  Bottom 0.152: v33.96,36.83 33.33,37.47 33.33,65.09 33.96,65.72 33.96,80.96 35.23,82.23 35.23,83.82 SV1.28 37.14,85.72 v37.14,104.14
INTA  (via drill 0.33)
  Top 0.152: IC13.28 63.81,92.08 59.04,92.08 58.73,92.39 53.96,92.39 51.74,90.17 v43.48,90.17
  Bottom 0.152: IC7.19 40.31,31.75 40.31,83.82 SV1.32 41.58,88.27 v43.48,90.17
LD
  Bottom 0.152: IC10.19 40.63,141.29 40.63,148.91 LOADING.A
LD-INS-REG  (via drill 0.33)
  Top 0.152: IC11.26 79.36,100.01 88.25,100.01 88.57,99.69 89.84,99.69 90.16,100.01 v106.03,100.01 | v106.03,86.36 106.03,85.72 106.35,85.41 106.35,82.55 SV3.35
  Bottom 0.152: IC2.13 105.08,38.1 SV3.35 | v106.03,100.01 105.72,99.69 105.72,92.39 105.4,92.08 105.4,87 v106.03,86.36
MEM-RD  (via drill 0.33)
  Top 0.152: v59.04,97.47 59.36,97.79 61.27,97.79 v63.17,99.69 | v84.12,103.5 81.9,105.73 66.66,105.73 IC13.23
  Bottom 0.152: IC7.13 50.15,37.15 50.15,49.85 51.42,51.12 59.36,51.12 59.36,93.34 59.04,93.66 v59.04,97.47 | v63.17,99.69 63.49,100.01 63.49,104.46 IC13.23 | SV3.21 86.35,83.5 86.35,84.45 86.03,84.77 86.03,88.58 85.08,89.53 85.08,93.03 84.12,93.98 v84.12,103.5
MEM-WR  (via drill 0.33)
  Top 0.152: IC7.12 52.69,33.97 83.17,33.97 v83.49,33.66 | v82.86,89.53 v62.22,89.53
  Bottom 0.152: v83.49,33.66 84.12,34.29 84.12,81.92 SV3.19 84.76,83.19 83.49,84.45 83.49,88.9 v82.86,89.53 | IC13.22 62.22,109.22 v62.22,89.53
N$1
  Bottom 0.152: R1.1 104.13,143.19 104.13,148.91 PWR1.A
N$6  (via drill 0.33)
  Top 0.152: IC10.9 26.66,122.24 v38.41,122.24 | C11.2 41.58,125.73 Q1.2
  Bottom 0.152: v38.41,122.24 41.58,125.41 Q1.2
N$7
  Top 0.152: IC10.10 27.93,120.97 41.58,120.97 Q1.1 41.58,120.65 C12.2
N$8
  Top 0.152: C13.1 DTR-RESET.2
N$17
  Bottom 0.152: IC10.21 22.21,126.05 22.21,115.25 C14.2
N$25
  Bottom 0.152: READY.K R11.1
N$26
  Bottom 0.152: LOADING.K R16.1
N$27
  Bottom 0.152: FAULT.K R6.1
N$30
  Top 0.152: IC10.23 16.18,137.79 14.28,137.79 UCODE.2
N$32
  Top 0.152: IC9.7 11.1,96.52 JP4.2
N$33
  Bottom 0.152: DTR-RESET.1 74.6,142.24 JP3.P$1
N$34
  Bottom 0.152: FTDI-VCC.2 82.22,144.78 JP3.P$4
N$39  (via drill 0.33)
  Top 0.152: v34.91,124.14 34.28,124.78 13.32,124.78 IC10.25
  Bottom 0.152: R25.1 34.91,106.36 v34.91,124.14 | START.1 22.53,149.86 22.53,150.18 21.58,151.13 14.91,151.13 14.91,130.81 IC10.25
OPERAND-CLK  (via drill 0.33)
  Top 0.152: v78.41,88.9 79.36,87.95 101.27,87.95 103.81,85.41 103.81,82.55 SV3.33
  Bottom 0.152: v78.41,88.9 IC11.28 | IC1.12 100.95,73.98 100.95,80.96 SV3.33
OUT-OFF  (via drill 0.33)
  Top 0.152: v79.05,80.96 78.73,81.28 74.28,81.28 73.33,82.23 73.33,85.09 SV3.10
  Bottom 0.152: IC2.19 79.36,35.88 79.36,75.56 79.05,75.88 v79.05,80.96 | IC11.21 74.92,111.76 74.92,112.08 73.65,113.35 72.38,113.35 72.06,113.67 71.11,113.67 71.11,112.71 71.42,112.39 71.42,92.39 72.06,91.76 SV3.10
OUT-ON  (via drill 0.33)
  Top 0.152: v70.79,69.85 IC3.11 | IC12.8 97.78,110.81 v74.92,110.81 | v73.01,86.36 70.79,86.36 SV3.8
  Bottom 0.152: v70.79,69.85 70.79,83.82 SV3.8 | v74.92,110.81 71.74,110.81 71.74,92.71 72.7,91.76 72.7,86.68 v73.01,86.36
REG-BRD-LD-ID  (via drill 0.33)
  Top 0.152: IC14.2 60,95.89 54.28,95.89 53.96,95.57 39.04,95.57 35.23,91.76 v28.25,91.76
  Bottom 0.152: IC8.12 28.56,35.24 28.56,79.38 28.25,79.69 28.25,81.92 SV1.21 28.88,83.5 27.61,84.77 27.61,91.12 v28.25,91.76
REG-BRD-RD-ID
  Top 0.152: IC14.26 52.69,98.74 44.12,98.74 41.58,96.2 25.39,96.2 19.04,89.85 14.28,89.85 12.05,87.63 12.05,86.36 16.5,86.36 17.45,85.41 17.45,82.55 SV1.13
  Bottom 0.152: IC5.17 18.72,72.39 SV1.13
REG-FUNC-LD  (via drill 0.33)
  Top 0.152: IC5.11 25.39,68.9 10.15,68.9 v6.02,73.03 1.57,73.03 1.57,109.54 3.48,111.44 52.69,111.44 IC14.21
  Bottom 0.152: SV1.3 v6.02,73.03
REG-FUNC-RD  (via drill 0.33)
  Top 0.152: IC5.12 25.39,73.34 v9.51,73.34 9.2,73.66 1.89,73.66 1.89,109.22 2.84,110.17 13.96,110.17 14.59,109.54 52.69,109.54 IC14.22
  Bottom 0.152: v9.51,73.34 8.56,74.3 SV1.5
REG-LD-HI  (via drill 0.33)
  Top 0.152: IC7.11 50.79,31.43 v47.93,31.43 | IC13.21 64.76,110.81 60.31,110.81 59.68,110.17 v51.42,110.17
  Bottom 0.152: v47.93,31.43 46.66,32.7 SV1.35 47.93,83.82 47.93,106.68 v51.42,110.17
REG-LD-ID0  (via drill 0.33)
  Top 0.152: IC8.13 29.2,38.42 v29.52,38.42 | IC14.3 59.68,98.11 v51.42,98.11 | v48.57,88.9 47.3,87.63 32.37,87.63 30.15,85.41 30.15,82.55 SV1.23
  Bottom 0.152: v29.52,38.42 30.79,39.69 30.79,81.92 SV1.23 | v51.42,98.11 48.57,95.25 v48.57,88.9
REG-LD-ID1  (via drill 0.33)
  Top 0.152: IC8.15 13.64,40.64 27.29,40.64 27.61,40.96 v31.74,40.96 | IC14.4 59.68,100.65 40.31,100.65 v36.5,96.84
  Bottom 0.152: v31.74,40.96 33.01,42.23 33.01,65.41 33.64,66.04 33.64,82.23 SV1.25 33.96,83.19 35.23,84.45 35.23,85.41 34.59,86.04 34.59,94.93 v36.5,96.84
REG-LD-ID2  (via drill 0.33)
  Top 0.152: IC8.16 15.23,39.69 v33.96,39.69 | IC14.5 60,103.5 v57.77,103.5 | v56.82,80.33 38.72,80.33 SV1.27
  Bottom 0.152: v33.96,39.69 34.28,40.01 34.28,80.33 SV1.27 | v57.77,103.5 56.82,102.55 v56.82,80.33
REG-LD-LO  (via drill 0.33)
  Top 0.152: IC8.18 12.37,31.75 v40.95,31.75 | v57.77,81.6 57.14,80.96 43.17,80.96 SV1.31
  Bottom 0.152: v40.95,31.75 41.58,32.38 SV1.31 | IC14.7 58.41,107 58.41,95.57 58.73,95.25 58.73,92.39 59.04,92.08 59.04,88.9 57.77,87.63 v57.77,81.6
REG-RD-HI  (via drill 0.33)
  Top 0.152: IC8.19 12.69,29.53 v39.68,29.53 | IC14.8 59.68,110.81 v46.66,110.81
  Bottom 0.152: v39.68,29.53 44.12,33.97 SV1.33 44.12,83.19 45.39,84.45 45.39,85.41 45.71,85.72 45.71,109.86 v46.66,110.81
REG-RD-ID0  (via drill 0.33)
  Top 0.152: IC5.18 13.96,72.71 v20.62,72.71 | IC14.27 52.38,95.89 30.79,95.89 v25.71,90.81 | v24.44,87.31 22.53,85.41 22.53,82.55 SV1.15
  Bottom 0.152: v20.62,72.71 21.26,73.34 SV1.15 | v25.71,90.81 24.44,89.53 v24.44,87.31
REG-RD-ID1  (via drill 0.33)
  Top 0.152: v19.36,80.01 20.62,81.28 22.53,81.28 SV1.17 | IC14.28 50.47,91.44 28.88,91.44 27.61,90.17 v23.17,90.17
  Bottom 0.152: IC5.19 19.36,67.31 v19.36,80.01 | v23.17,90.17 22.53,89.53 22.53,84.45 23.8,83.19 SV1.17
REG-RD-ID2  (via drill 0.33)
  Top 0.152: v60.31,79.38 60,79.69 30.15,79.69 27.29,82.55 SV1.19
  Bottom 0.152: IC8.11 24.44,30.48 24.44,80.64 SV1.19 | IC14.1 60.63,79.69 v60.31,79.38
REG-RD-LO  (via drill 0.33)
  Top 0.152: IC8.17 12.69,34.61 v40.95,34.61 | v40.95,80.96 39.36,82.55 SV1.29 | IC14.6 59.68,105.73 45.07,105.73 v44.12,106.68
  Bottom 0.152: v40.95,80.96 v40.95,34.61 | v44.12,106.68 40.31,102.87 40.31,84.45 39.04,83.19 SV1.29
SCL
  Top 0.152: R5.1 10.78,101.92 15.86,101.92 IC9.6 | 61.58,122.87 IC14.12 | 72.38,122.87 61.58,122.87 | IC13.12 72.38,122.87 | 85.08,122.87 IC11.12 | 72.38,122.87 85.08,122.87 | 97.78,122.87 IC12.12 | 85.08,122.87 97.78,122.87 | IC1-5.12 110.48,122.87 97.78,122.87 | IC10.28 7.61,122.87 61.58,122.87
  Bottom 0.152: IC10.28 4.43,126.05 4.43,110.17 R5.1
SDA
  Top 0.152: 85.08,123.51 IC11.13 | 85.08,123.51 74.28,123.51 IC13.13 72.38,125.41 61.58,125.41 IC14.13 59.68,123.51 9.51,123.51 IC10.27 | 97.78,123.51 IC12.13 | 85.08,123.51 97.78,123.51 | IC1-5.13 110.48,123.51 97.78,123.51
  Bottom 0.152: R12.1 5.07,107 5.07,113.98 | 5.07,113.98 5.07,126.05 IC10.27 | IC9.5 19.36,100.97 19.36,104.46 18.4,105.41 18.4,113.67 18.09,113.98 5.07,113.98
SOFT-RESET  (via drill 0.33)
  Top 0.152: IC2.18 86.35,31.43 v82.86,31.43
  Bottom 0.152: v82.86,31.43 79.05,35.24 79.05,64.77 77.46,66.36 73.33,66.36 73.33,83.82 SV3.12 74.92,85.41 74.92,105.73 IC11.22
SR-LD  (via drill 0.33)
  Top 0.152: IC3.15 62.85,76.52 79.05,76.52 79.68,77.15 v81.27,77.15 | v95.56,89.85 94.28,88.58 v81.59,88.58
  Bottom 0.152: v81.27,77.15 82.22,78.11 SV3.17 82.22,83.19 80.95,84.45 80.95,87.95 v81.59,88.58 | IC12.5 96.19,101.6 96.19,93.03 95.24,92.08 95.24,90.17 v95.56,89.85
TEST-IN  (via drill 0.33)
  Top 0.152: v82.86,78.74 81.59,80.01 61.27,80.01 57.45,83.82 45.39,83.82 SV1.34
  Bottom 0.152: IC2.17 82.86,33.02 v82.86,78.74
TMP-REG-LD  (via drill 0.33)
  Top 0.152: IC6.11 51.11,69.22 37.77,69.22 37.14,68.58 v9.51,68.58 | v73.33,88.27 72.38,87.31 59.04,87.31 v58.73,87.63
  Bottom 0.152: v9.51,68.58 7.29,70.8 7.29,83.82 SV1.4 | v73.33,88.27 IC13.1 | v58.73,87.63 58.41,87.31 58.41,75.88 52.38,69.85 IC6.11
TMP-REG-RD  (via drill 0.33)
  Top 0.152: IC6.12 51.11,73.03 40.31,73.03 37.14,76.2 10.46,76.2 7.29,79.38 7.29,85.09 SV1.6 | IC13.2 72.38,95.57 62.54,95.57 61.9,94.93 v58.09,94.93
  Bottom 0.152: v58.09,94.93 57.14,93.98 57.14,80.96 57.45,80.64 57.45,75.56 54.28,72.39 IC6.12
UCODE-COUNT-RESET  (via drill 0.33)
  Top 0.152: IC11.27 79.36,97.47 v108.25,97.47 | v108.57,86.36 108.57,85.72 108.89,85.41 108.89,84.45 108.57,84.45 107.62,83.5 SV3.37
  Bottom 0.152: IC2.12 108.25,38.73 108.25,63.82 108.57,64.14 108.57,81.6 SV3.37 | v108.25,97.47 107.94,97.16 107.94,87 v108.57,86.36
UNUSED1
  Top 0.152: IC14.25 52.38,100.97 22.53,100.97 16.82,95.25 6.34,95.25 2.21,91.12 2.21,74.93 IC5.16
  Bottom 0.152: IC5.16 16.18,74.93 SV1.11
VCC
  Top 0.152: 67.3,40.96 43.8,40.96 C18.2 42.53,41.59 21.26,41.59 20.62,40.96 19.04,40.96 17.77,42.23 | C19.2 67.3,40.96 | C17.2 92.7,40.96 67.3,40.96 | IC5.28 13.64,41.91 C23.2 17.77,42.23 | 35.55,45.4 IC6.28 | 35.55,45.4 20.94,45.4 17.77,42.23 | 60.95,45.4 IC3.28 | 35.55,45.4 60.95,45.4 | IC1.28 86.35,45.4 60.95,45.4 | IC8.28 13.64,2.54 C21.2 19.04,4.13 37.45,4.13 | C16.2 89.84,2.54 IC2.28 85.71,3.49 69.2,3.49 C22.2 64.44,2.54 62.85,4.13 | 37.45,4.13 39.04,2.54 C20.2 44.44,4.13 62.85,4.13 | 37.45,4.13 IC7.28 | 62.85,4.13 IC4.28 | R25.2 43.17,106.36 20.94,106.36 C15.2 19.04,106.36 13.64,106.36 | SV1.2 SV1.1 | IC9.1 IC9.2 IC9.3 | R5.2 13.64,106.36 | 13.64,106.36 R12.2 | IC9.8 11.1,99.06 JP4.3 | C6.2 58.41,91.76 66.98,91.76 67.61,92.39 69.84,92.39 | C5.2 69.84,92.39 | 82.54,92.39 C4.2 | 69.84,92.39 82.54,92.39 | 82.54,92.39 95.24,92.39 C3.2 101.27,91.44 102.22,92.39 107.94,92.39 C2.2 | IC12.15 IC12.16 | ROM.7 ROM.9 | 97.78,115.25 IC12.9 | 97.78,115.25 86.98,115.25 IC11.9 | IC1-5.9 110.48,115.25 97.78,115.25 | IC10.20 25.39,128.59 46.02,128.59 47.61,127 IC14.15
  Bottom 0.152: R3.2 9.51,21.91 9.51,6.67 IC8.28 | C22.2 C19.2 | IC10.7 19.04,119.06 19.04,110.49 | 19.04,110.49 19.04,106.36 C15.2 | IC10.20 22.53,125.73 22.53,113.98 19.04,110.49 | SV1.2 11.1,92.71 IC9.1 IC9.8 12.37,104.14 R12.2 | 2.53,112.08 R8.1 | 2.53,112.08 2.53,103.82 JP4.3 | UCODE.1 2.53,134.94 2.53,112.08 | 91.11,132.08 R1.2 | IC12.15 91.11,132.08 | FTDI-VCC.1 91.11,133.35 91.11,132.08 | IC14.9 64.12,117.79 64.12,120.33 | 64.12,120.97 64.12,122.87 IC13.16 | 64.12,120.97 64.12,120.33 | 70.79,116.84 67.3,120.33 64.12,120.33 | 70.79,116.84 IC13.9 77.46,118.43 80,118.43 80,120.33 | IC14.15 59.04,120.97 64.12,120.97 | ROM.7 ROM.5 | IC11.17 80,120.33 | 80,120.33 IC11.9 | ROM.9 113.02,74.93 113.02,112.71 IC1-5.9 | IC12.16 86.98,120.33 80,120.33 | C5.2 71.11,91.76 71.11,112.08 70.79,112.39 70.79,116.84 | C23.2 13.64,45.72 13.64,64.14 11.42,66.36 3.48,66.36 SV1.1
VPGM
  Top 0.152: IC8.1 27.29,6.03 50.79,6.03 | IC7.1 50.79,6.03 | 76.19,6.03 IC4.1 | 50.79,6.03 76.19,6.03 | IC2.1 101.59,6.03 76.19,6.03 | IC5.1 27.29,43.5 50.79,43.5 | IC6.1 50.79,43.5 | 76.19,43.5 IC3.1 | 50.79,43.5 76.19,43.5 | IC1.1 101.59,43.5 76.19,43.5
  Bottom 0.152: ROM.8 106.35,71.12 106.35,37.47 103.49,34.61 100.95,34.61 | 100.95,34.61 100.95,42.86 IC1.1 | IC2.1 100.95,6.67 100.95,34.61

## Text on the board
Top: fix ic label placement
tNames: DOWN / LOAD | WRITE / MEM | WP | YACC1 SEQUENCER MEMORY BOARD V1.0 | www.onepagecomputer.com